# Altium schematic sheet AAS_module_Power-rev1_2.SchDoc: Power
size A3; Author: Richard Kubíček; DocumentNumber: 4; SheetNumber: 4; SheetTotal: 4; PageSize: A3; DruhPraceRadek1: Diplomová; DruhPraceRadek2: práce
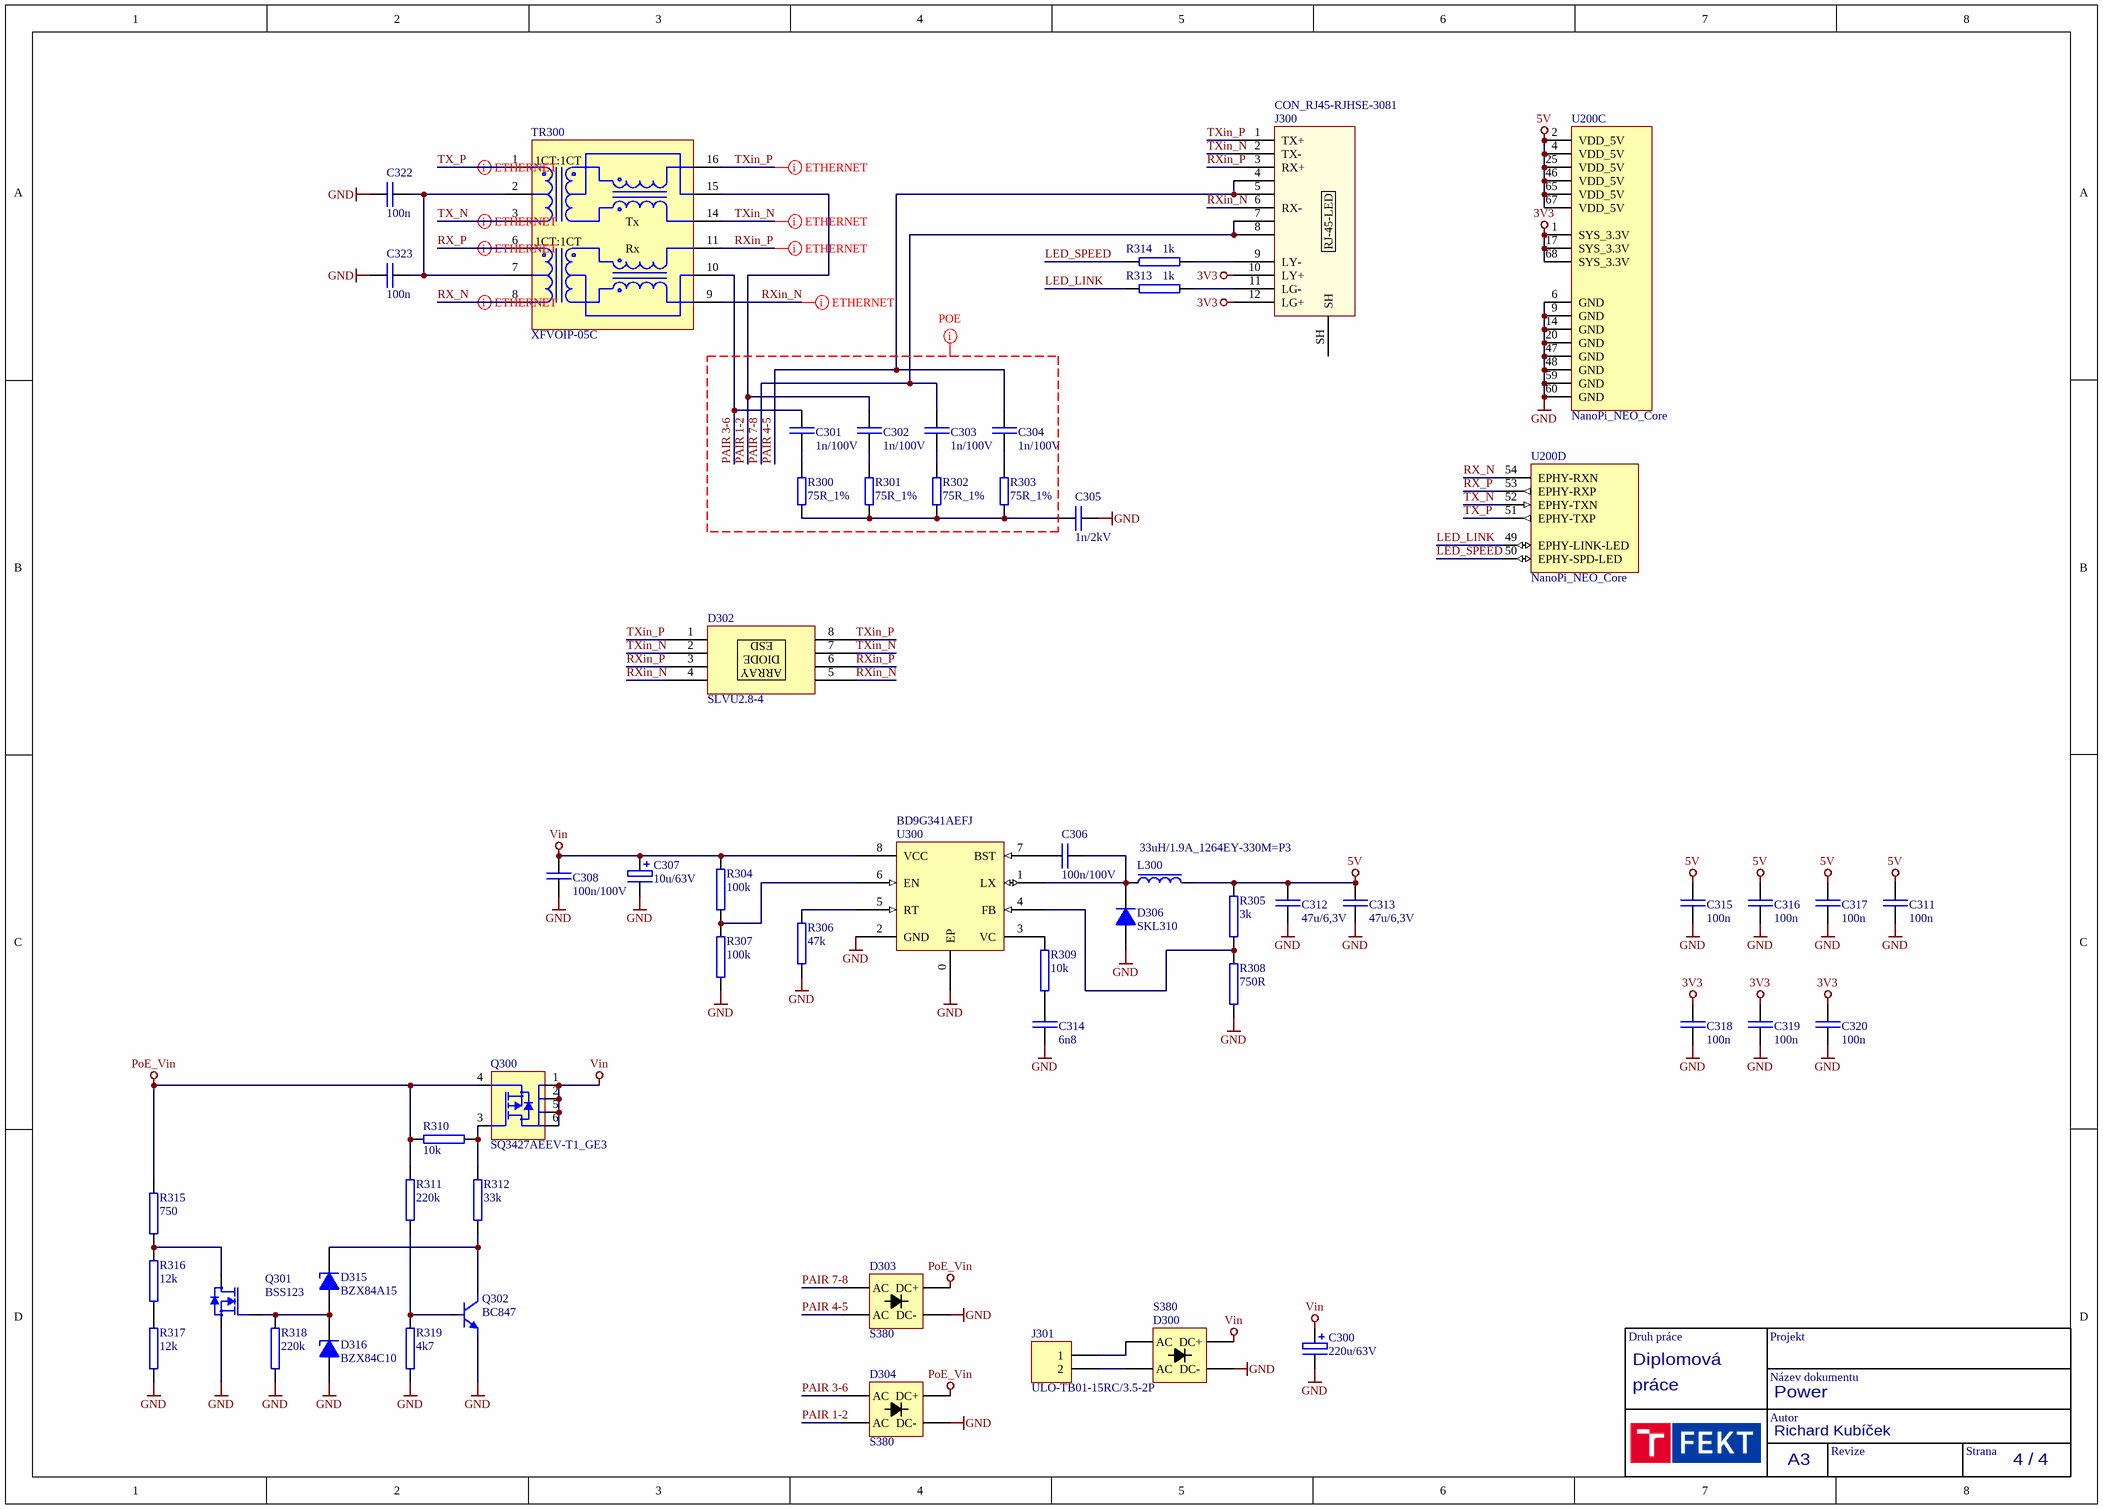
[diagram p0: AAS_module_Power-rev1_2.SchDoc]

## Parts
C300  220u/63V  [CAP_D10xL20_P5_HR]
C301  1n/100V  [C0603]
C302  1n/100V  [C0603]
C303  1n/100V  [C0603]
C304  1n/100V  [C0603]
C305  1n/2kV  [C1206]
C306  100n/100V  [C1206]
C307  10u/63V  [C_ALU_D6x5.8]
C308  100n/100V  [C1206]
C311  100n  [C0603]
C312  47u/6,3V  [C1206]
C313  47u/6,3V  [C1206]
C314  6n8  [C0805]
C315  100n  [C0603]
C316  100n  [C0603]
C317  100n  [C0603]
C318  100n  [C0603]
C319  100n  [C0603]
C320  100n  [C0603]
C322  100n  [C0603]
C323  100n  [C0603]
D300  S380  [MBS]
D302  SLVU2.8-4  [SO-8]
D303  S380  [MBS]
D304  S380  [MBS]
D306  SKL310  [SOD123]
D315  BZX84A15  [SOT-23]
D316  BZX84C10  [SOT-23]
J300  CON_RJ45-RJHSE-3081  [RJHSE-3081]
J301  ULO-TB01-15RC/3.5-2P  [ULO-TB01-15VC-3.5-2P]
L300  33uH/1.9A_1264EY-330M=P3  [L_MURATA-DG6050C]
Q300  SQ3427AEEV-T1_GE3  [SOT-23-6]
Q301  BSS123  [SOT-23]
Q302  BC847  [SOT-23]
R300  75R_1%  [R_0805]
R301  75R_1%  [R_0805]
R302  75R_1%  [R_0805]
R303  75R_1%  [R_0805]
R304  100k  [R0603]
R305  3k  [R0603]
R306  47k  [R0603]
R307  100k  [R0603]
R308  750R  [R0603]
R309  10k  [R0603]
R310  10k  [R0603]
R311  220k  [R0603]
R312  33k  [R0603]
R313  1k  [R0603]
R314  1k  [R0603]
R315  750  [R0603]
R316  12k  [R0603]
R317  12k  [R0603]
R318  220k  [R0603]
R319  4k7  [R0603]
TR300  XFVOIP-05C  [XFVOIP-05]
U200  NanoPi_NEO_Core  [NanoPi_NEO_Core_right]  (parts C,D of 4)
U300  BD9G341AEFJ  [SO-8_EP]

## Nets
3V3: C318.1 C319.1 C320.1 J300.10(LY+) J300.12(LG+) U200.1(SYS_3.3V) U200.17(SYS_3.3V) U200.68(SYS_3.3V)
5V: C311.1 C312.1 C313.1 C315.1 C316.1 C317.1 L300.2 R305.2 U200.2(VDD_5V) U200.4(VDD_5V) U200.25(VDD_5V) U200.46(VDD_5V) U200.65(VDD_5V) U200.67(VDD_5V)
GND: C300.2(-) C305.2 C307.2(-) C308.2 C311.2 C312.2 C313.2 C314.1 C315.2 C316.2 C317.2 C318.2 C319.2 C320.2 C322.1 C323.1 D300.2(DC-) D303.2(DC-) D304.2(DC-) D306.A D316.A Q301.S Q302.E R306.1 R307.1 R308.1 R317.1 R318.1 R319.1 U200.6(GND) U200.9(GND) U200.14(GND) U200.20(GND) U200.47(GND) U200.48(GND) U200.59(GND) U200.60(GND) U300.0(EP) U300.2(GND)
PoE_Vin: D303.1(DC+) D304.1(DC+) Q300.4(S) R310.2 R311.2 R315.2
Vin: C300.1(+) C307.1(+) C308.1 D300.1(DC+) Q300.1(D) Q300.2(D) Q300.5(D) Q300.6(D) R304.2 U300.8(VCC)
LED_LINK: R313.2 U200.49(EPHY-LINK-LED)
LED_SPEED: R314.2 U200.50(EPHY-SPD-LED)
PAIR 1-2: C302.1 D304.4(AC) TR300.15(TXCT)
PAIR 3-6: C301.1 D304.3(AC) TR300.10(RXCT)
PAIR 4-5: C304.1 D303.4(AC) J300.4 J300.5
PAIR 7-8: C303.1 D303.3(AC) J300.7 J300.8
RX_N: TR300.8(RD-) U200.54(EPHY-RXN)
RX_P: TR300.6(RD+) U200.53(EPHY-RXP)
RXin_N: D302.4 D302.5 J300.6(RX-) TR300.9(RX1-)
RXin_P: D302.3 D302.6 J300.3(RX+) TR300.11(RX1+)
TX_N: TR300.3(TD-) U200.52(EPHY-TXN)
TX_P: TR300.1(TD+) U200.51(EPHY-TXP)
TXin_N: D302.2 D302.7 J300.2(TX-) TR300.14(TX1-)
TXin_P: D302.1 D302.8 J300.1(TX+) TR300.16(TX1+)
NetC301_2: C301.2 R300.2
NetC302_2: C302.2 R301.2
NetC303_2: C303.2 R302.2
NetC304_2: C304.2 R303.2
NetC305_1: C305.1 R300.1 R301.1 R302.1 R303.1
NetC306_1: C306.1 U300.7(BST)
NetC306_2: C306.2 D306.K L300.1 U300.1(LX)
NetC314_2: C314.2 R309.1
NetC322_2: C322.2 C323.2 TR300.2(TCT) TR300.7(RCT)
NetD300_3: D300.3(AC) J301.1
NetD300_4: D300.4(AC) J301.2
NetD315_A: D315.A D316.K Q301.G R318.2
NetD315_K: D315.K Q302.C R312.1
NetJ300_9: J300.9(LY-) R314.1
NetJ300_11: J300.11(LG-) R313.1
NetQ300_3: Q300.3(G) R310.1 R312.2
NetQ301_D: Q301.D R315.1 R316.2
NetQ302_B: Q302.B R311.1 R319.2
NetR304_1: R304.1 R307.2 U300.6(EN)
NetR305_1: R305.1 R308.2 U300.4(FB)
NetR306_2: R306.2 U300.5(RT)
NetR309_2: R309.2 U300.3(VC)
NetR316_1: R316.1 R317.2

Not connected (* = marked no-connect by the designer): J300 SH; TR300 4(NC) 5(NC) 12(NC) 13(NC)

## Layout directives
net class POE: PAIR 1-2, PAIR 3-6, PAIR 4-5, PAIR 7-8
differential pair: RX_N, RX_P, RXin_N, RXin_P, TX_N, TX_P, TXin_N, TXin_P

## Notes on the sheet
- Druh práce
- Název dokumentu
- Projekt
- Autor
- Revize
- Strana
- (in symbol CON_RJ45-LED_DESCRIPTION) RJ-45-LED
- (in symbol SLVU2.8-4) ESD; DIODE; ARRAY
- (in symbol XFVOIP-05) 1CT:1CT; Tx; Rx

## Library data of the parts
C300 = C_ELYT: Electrolytic Capacitor; TME: EGT477M1JI20RRSHP
C301-C304 C311 C315-C320 C322 C323 = C_0603: Capacitor SMD 0603
C305 C306 C308 C312 C313 = C_1206: Capacitor SMD 1206
C307 = C_ALU: Electrolytic Aluminium Capacitor
C314 = C_0805: Capacitor SMD 0805
D300 D303 D304 = _DIODE_BRIDGE_RECTIFIER: Diode rectifier
D302 = SLVU2.8-4: EPD TVS Diode Array  For ESD and Latch-Up Protection
D306 = 1N4007: Diode
D315 D316 = BZX84CXXX: Zener diode; pin to pad: A>1 K>3
J300 = CON_RJ45-LED_DESCRIPTION
J301 = CON_ULO-TB01-15RC/3.5-2P: Connector 15EDG pitch 3.5mm Right Angle
L300 = 44: ID: 44; ABRA number: 94369; UR: 1; Value: 1264EY-330M=P3; Induction: 33uH/1.9A; Technology: SMT; Supplier 1: https://cz.mouser.com/ProductDetail/Murata-Electronics/1264EY-330M%3dP3?qs=sGAEpiMZZMsg%252by3WlYCkU588IWvyRtFzXhS%252bh6Vmel8%3d
Q300 = 38: ID: 38; UR: 1; Value: SQ3427AEEV-T1_GE3; HelpURL: https://cz.mouser.com/ProductDetail/Vishay-Siliconix/SQ3427AEEV-T1_GE3?qs=sGAEpiMZZMshyDBzk1%2FWi7D7EaJfF%252Bz4Xfx7fw3JA1J5zUvCnpY8Yg%3D%3D; Technology: SMT
Q301 = BSS138: N-Channel MOSFET; pin to pad: D>3 G>1 S>2
Q302 = BC847: NPN Transistor; pin to pad: B>1 C>3 E>2
R300-R303 = 101: ID: 101; Value: 75R; Tolerance: 1; ABRA number: 120149; ABS: 75; Technology: SMT; UR: 1
R304-R319 = R_0603: Resistor SMD 0603
TR300 = XFVOIP-05: LAN magnetics with filter; LCSC: HY601742
U300 = BD9G341AEFJ: 12V to 76V input voltage range 3A output current